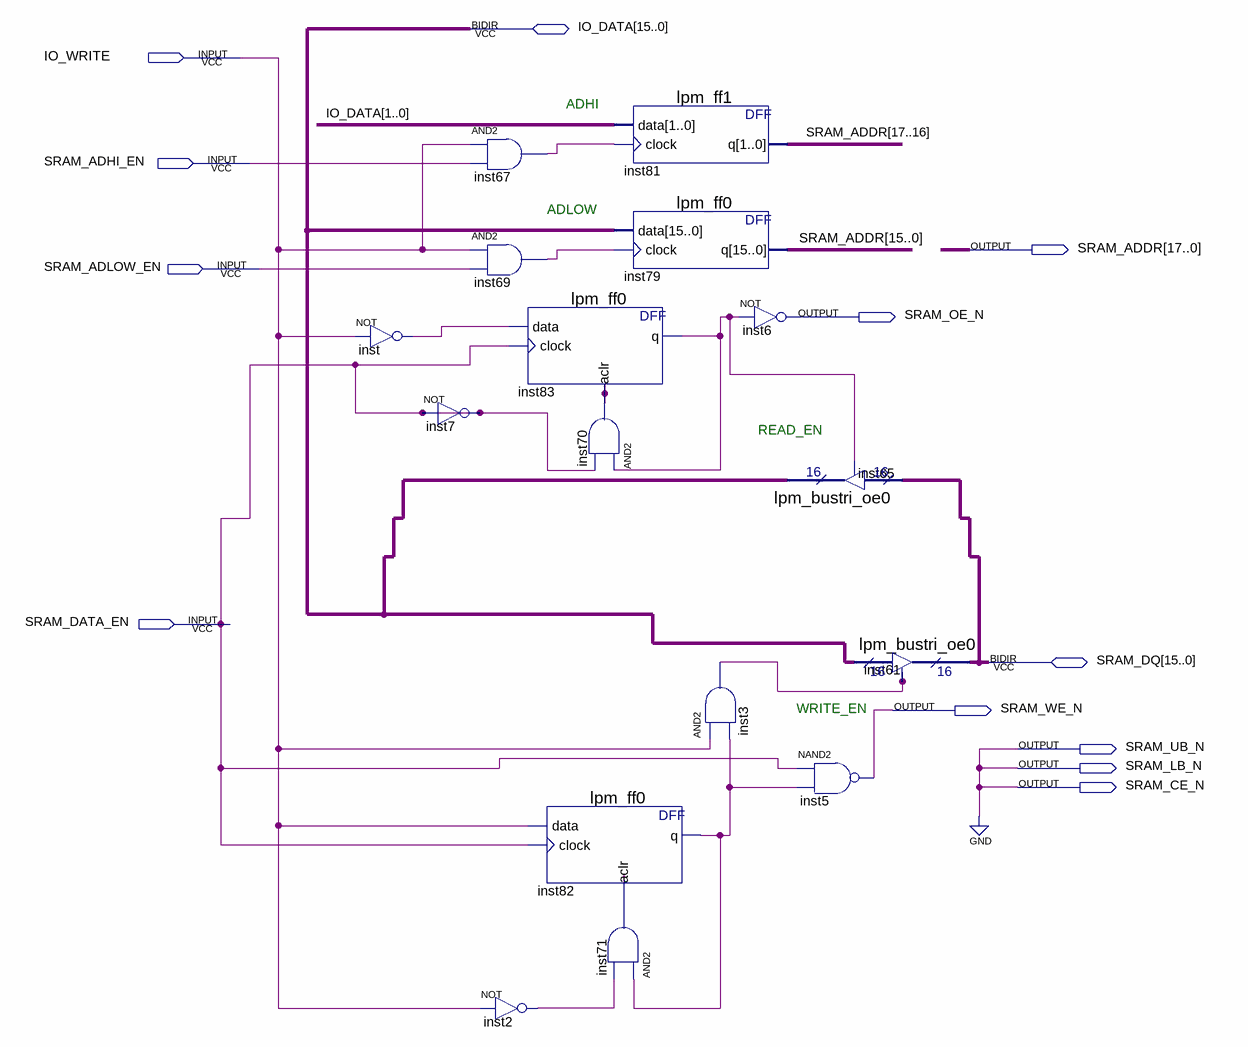
[diagram p0: schematic sheet]
// Quartus schematic RAMS_SRAM.bdf as structural Verilog: 16 symbols, 12 pins
module RAMS_SRAM (
  input  IO_WRITE,
  input  SRAM_ADHI_EN,
  input  SRAM_ADLOW_EN,
  input  SRAM_DATA_EN,
  inout  [15:0] IO_DATA,
  inout  [15:0] SRAM_DQ,
  output [17:0] SRAM_ADDR,
  output SRAM_OE_N,
  output SRAM_WE_N,
  output SRAM_UB_N,
  output SRAM_LB_N,
  output SRAM_CE_N
);

  wire inst2_out, inst3_out, inst67_out, inst69_out, inst70_out, inst71_out, inst82_q, inst83_q, inst_out;

  not inst (inst_out, IO_WRITE);
  not inst7 (SRAM_DATA_EN, SRAM_DATA_EN);
  and inst67 (inst67_out, IO_WRITE, SRAM_ADHI_EN);
  and inst69 (inst69_out, IO_WRITE, SRAM_ADLOW_EN);
  lpm_ff0 inst83 (.data(inst_out), .clock(SRAM_DATA_EN), .aclr(inst70_out), .q(inst83_q));
  not inst2 (inst2_out, IO_WRITE);
  and inst70 (inst70_out, inst83_q, SRAM_DATA_EN);
  lpm_ff0 inst82 (.data(IO_WRITE), .clock(SRAM_DATA_EN), .aclr(inst71_out), .q(inst82_q));
  and inst71 (inst71_out, inst82_q, inst2_out);
  lpm_ff1 inst81 (.data(IO_DATA[1:0]), .clock(inst67_out), .q(SRAM_ADDR[17:16]));
  lpm_ff0 inst79 (.data(IO_DATA), .clock(inst69_out), .q(SRAM_ADDR[15:0]));
  not inst6 (SRAM_OE_N, inst83_q);
  and inst3 (inst3_out, IO_WRITE, inst82_q);
  lpm_bustri_oe0 inst65 (.enabledt(inst83_q), .data(SRAM_DQ), .tridata(IO_DATA));
  nand inst5 (SRAM_WE_N, SRAM_DATA_EN, inst82_q);
  lpm_bustri_oe0 inst61 (.enabledt(inst3_out), .data(IO_DATA), .tridata(SRAM_DQ));

  assign SRAM_CE_N = 1'b0;
  assign SRAM_LB_N = 1'b0;
  assign SRAM_UB_N = 1'b0;

  // Notes on the sheet:
  //   ADHI
  //   ADLOW
  //   READ_EN
  //   WRITE_EN
endmodule
